# EAGLE design QFN-20_5x5mm_Breakout (EAGLE 9.6.2)
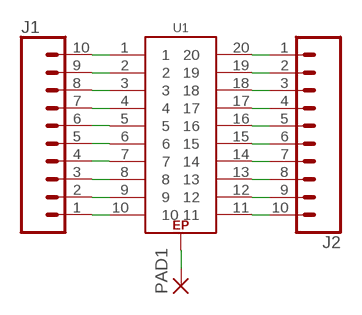
[diagram p0: schematic, sheet 1]

## Parts
J1  CONN_10"  [1X10]
J2  CONN_10"  [1X10]
PAD1  SMD2  [SMD1,27-2,54]
U1  GEN_20_EPQFN-20_5X5  [QFN20_5X5]

## Nets
N$1: PAD1.1(P) U1.EP
N$2: J1.10 U1.1
N$3: J1.9 U1.2
N$4: J1.8 U1.3
N$5: J1.7 U1.4
N$6: J1.6 U1.5
N$7: J1.5 U1.6
N$8: J1.4 U1.7
N$9: J1.3 U1.8
N$10: J1.2 U1.9
N$11: J1.1 U1.10
N$12: J2.10 U1.11
N$13: J2.9 U1.12
N$14: J2.8 U1.13
N$15: J2.7 U1.14
N$16: J2.6 U1.15
N$17: J2.5 U1.16
N$18: J2.4 U1.17
N$19: J2.3 U1.18
N$20: J2.2 U1.19
N$21: J2.1 U1.20

## Library data of the parts
J1 J2 = bschulz:CONN_10: Genaric 10 terminal header Digikey 2.54_SCREW <https://www.digikey.com/product-detail/en/on-shore-technology-inc/OSTVN10A150/ED10567-ND/1588870> 3.5_SCREW <https://www.digikey.com/product-detail/en/on-shore-technology-inc/OSTTE100104/ED2735-ND/2351811>; PROD_ID: CONN-11563
PAD1 = bschulz:SMD2: SMD PAD; DIGIKEY: N/A; MF: N/A; MPN: DNP
U1 = bschulz:GEN_20_EP: Generic 20 Pin Package for Breakout Boards

## Board
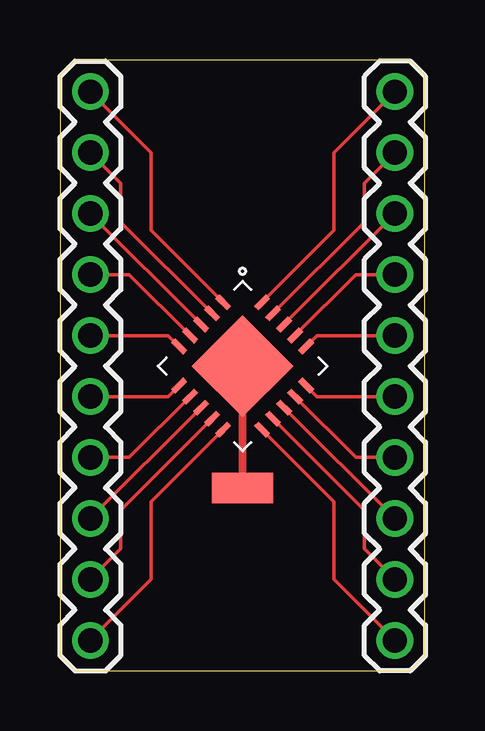
[diagram p1: board, top side]

Size 15.22 x 25.45 mm. Coordinates in mm from the lower left corner, seen from the top.
Outline: 15.22,0.64 15.22,24.82 14.59,25.45 0.64,25.45 0,24.82 0,0.64 0.64,0 14.59,0 15.22,0.64
Copper layers (1*16): Top 0.035559375mm / dielectric 1.6mm / Bottom 0.035559375mm
Design rules "oshpark-2layer": minimum track width 6mil, minimum drill 10mil, track to track 6mil, track to pad 6mil, pad to pad 6mil, via to via 6mil, smd to smd 6mil, copper to edge 15mil, drill to drill 6mil, minimum pad ring 5mil, minimum via ring 5mil, stop-mask expansion 2.5mil, vias tented up to drill 0mil, thermal gap 10mil

### Footprints (pad centres in the part's own frame; a part is rotated, then mirrored left to right if it is on the bottom)
1X10 = drill 1.016: 1 0,0; 2 2.54,0; 3 5.08,0; 4 7.62,0; 5 10.16,0; 6 12.7,0; 7 15.24,0; 8 17.78,0; 9 20.32,0; 10 22.86,0
SMD1,27-2,54 = smd 1.27 x 2.54: 1 0,0
QFN20_5X5 = smd 0.7 x 0.25: 1 -2.45,1.3; 2 -2.45,0.65; 3 -2.45,0; 4 -2.45,-0.65; 5 -2.45,-1.3; 11 2.45,-1.3; 12 2.45,-0.65; 13 2.45,0; 14 2.45,0.65; 15 2.45,1.3 | smd 0.25 x 0.7: 6 -1.3,-2.45; 7 -0.65,-2.45; 8 0,-2.45; 9 0.65,-2.45; 10 1.3,-2.45; 16 1.3,2.45; 17 0.65,2.45; 18 0,2.45; 19 -0.65,2.45; 20 -1.3,2.45 | smd 3 x 3: EP 0,0

### Placement (x,y rotation side)
J1  1.27,1.27 90 top
J2  13.97,24.13 270 top
PAD1  7.62,7.62 90 top
U1  7.62,12.7 315 top

### Tracks (layer width: path | path; a pad name or v marks a point on that pad's centre or on a via)
N$1
  Top 0.305: PAD1.1 U1.EP
N$2
  Top 0.152: U1.1 3.81,18.35 3.81,21.59 J1.10
N$3
  Top 0.152: U1.2 2.54,18.7 2.54,20.32 J1.9
N$4
  Top 0.152: J1.8 U1.3 | U1.3
N$5
  Top 0.152: U1.4 2.89,16.51 J1.7
N$6
  Top 0.152: U1.5 4.51,13.97 J1.6
N$7
  Top 0.152: U1.6 4.51,11.43 J1.5
N$8
  Top 0.152: U1.7 2.89,8.89 J1.4
N$9
  Top 0.152: U1.8 J1.3
N$10
  Top 0.152: U1.9 2.54,6.7 2.54,5.08 J1.2
N$11
  Top 0.152: U1.10 3.81,7.05 3.81,3.81 J1.1
N$12
  Top 0.152: U1.11 11.43,7.05 11.43,3.81 J2.10
N$13
  Top 0.152: U1.12 12.7,6.7 12.7,5.08 J2.9
N$14
  Top 0.152: J2.8 | J2.8 U1.13
N$15
  Top 0.152: J2.7 12.35,8.89 U1.14
N$16
  Top 0.152: U1.15 10.73,11.43 J2.6
N$17
  Top 0.152: U1.16 10.73,13.97 J2.5
N$18
  Top 0.152: U1.17 12.35,16.51 J2.4
N$19
  Top 0.152: U1.18 J2.3
N$20
  Top 0.152: U1.19 12.7,18.7 12.7,20.32 J2.2
N$21
  Top 0.152: J2.1 11.43,21.59 11.43,18.35 U1.20

### Text on the board
tDocu: 1 | 20 | 2 | QFN-20 / 5x5mm / 0.65mm pitch | 19 | 3 | 18 | 4 | 17 | 5 | 16 | 6 | 15 | 7 | 14 | 8 | EP | 13 | 9 | 12 | Break44 / B. Schulz | 10 | 11